# EAGLE design Example (EAGLE 9.6.2)
REVISION: 1.0; SCH_DESC: An Example Schematic; TEAM: Example_Team_Number
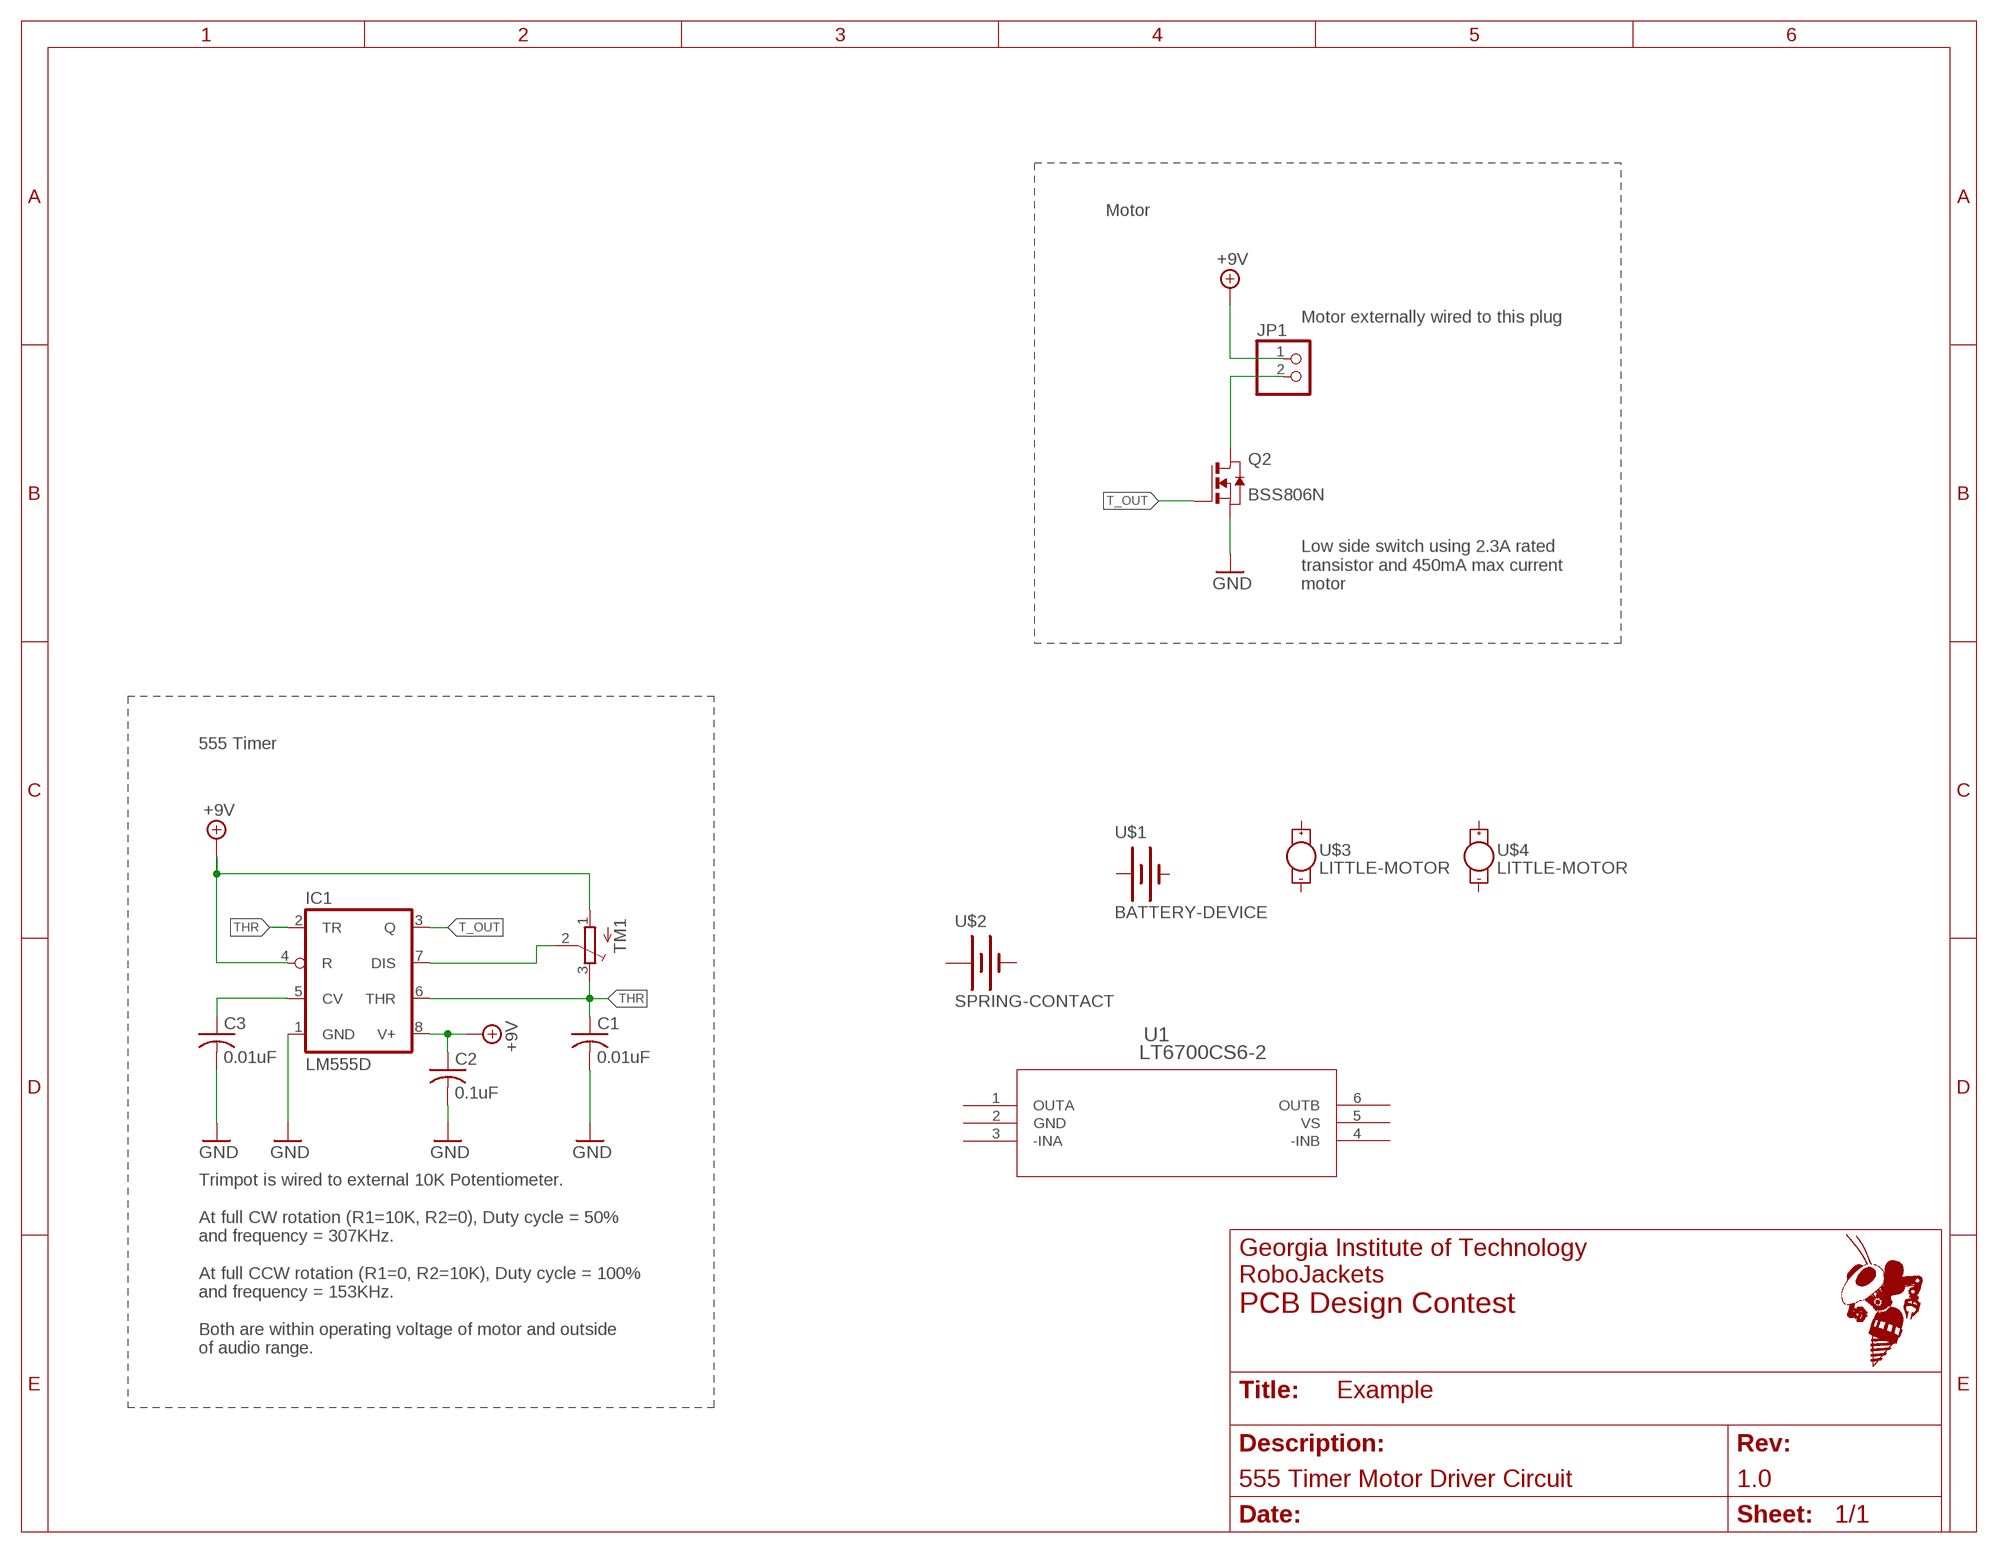
[diagram p0: schematic, sheet 1]
FRAME2 (FRAME_A_L): REVISION: 1.0; SCH_DESC: 555 Timer Motor Driver Circuit; TEAM: PCB Design Contest

## Parts
C1  0.01uF  C-USC0603  [C0603]
C2  0.1uF  C-USC0603  [C0603]
C3  0.01uF  C-USC0603  [C0603]
IC1  LM555D  [SO08]
JP1  PINHD-1X2  [1X02]
Q2  BSS806N  [SOT-23-3]
TM1  TRIMPOT3386  [TRIM-3386]
U1  LT6700CS6-2  [TSOT-23_S6]
U$1  BATTERY-DEVICE  [BATTERY-CASE]
U$2  SPRING-CONTACT  [SPRING-CONTACT]
U$3  LITTLE-MOTOR  [DC_MOTOR]
U$4  LITTLE-MOTOR  [DC_MOTOR]

## Nets
+9V: C2.1 IC1.4(R) IC1.8(V+) JP1.1 TM1.1(A)
GND: C1.2 C2.2 C3.2 IC1.1(GND) Q2.2(S)
N$1: IC1.7(DIS) TM1.2(S)
N$2: JP1.2 Q2.3(D)
N$3: C3.1 IC1.5(CV)
T_OUT: IC1.3(Q) Q2.1(G)
THR: C1.1 IC1.2(TR) IC1.6(THR) TM1.3(E)
Unconnected: U1.1(OUTA) U1.3(-INA) U1.4(-INB) U1.6(OUTB)

## Notes on the sheet
- Motor
- Motor externally wired to this plug
- Low side switch using 2.3A rated
  transistor and 450mA max current
  motor
- 555 Timer
- Trimpot is wired to external 10K Potentiometer.
  
  At full CW rotation (R1=10K, R2=0), Duty cycle = 50%
  and frequency = 307KHz.
  
  At full CCW rotation (R1=0, R2=10K), Duty cycle = 100%
  and frequency = 153KHz.
  
  Both are within operating voltage of motor and outside
  of audio range.

## Power pins joined to a net without a drawn wire
GND: U1.2(GND)
VS: U1.5(VS)

## Library data of the parts
C1-C3 = rcl:C-US: CAPACITOR, American symbol; SPICEPREFIX: C
IC1 = adafruit:*555: TIMER Changed DIP package to have round (not oval) pin pads http://www.ladyada.net/library/pcb/eaglelibrary.html
JP1 = RoboJackets-Connectors:PINHD-1X2: PIN HEADER
Q2 = RoboJackets-Discrete:BSS806N; DKPN: BSS806NH6327XTSA1CT-ND
TM1 = adafruit:TRIMPOT: SMT trimmer potentiometer part number TC33X http://www.ladyada.net/library/eagle
U1 = LT6700CS6-2:LT6700CS6-2; DESCRIPTION: Analog Comparators LT6700 - Micropower, Low Voltage, Dual Comparator with 400mV Reference; DIGI-KEY_PART_NUMBER: LT6700CS6-2#TRMPBFCT-ND; MF: Analog Devices / Linear Technology; MP: LT6700CS6-2; PACKAGE: None
U$1 = battery-stringshooter-holder-18650:BATTERY-DEVICE
U$2 = battery-contact-AA:SPRING-CONTACT
U$3 U$4 = motor-stringshooter:LITTLE-MOTOR

## Board
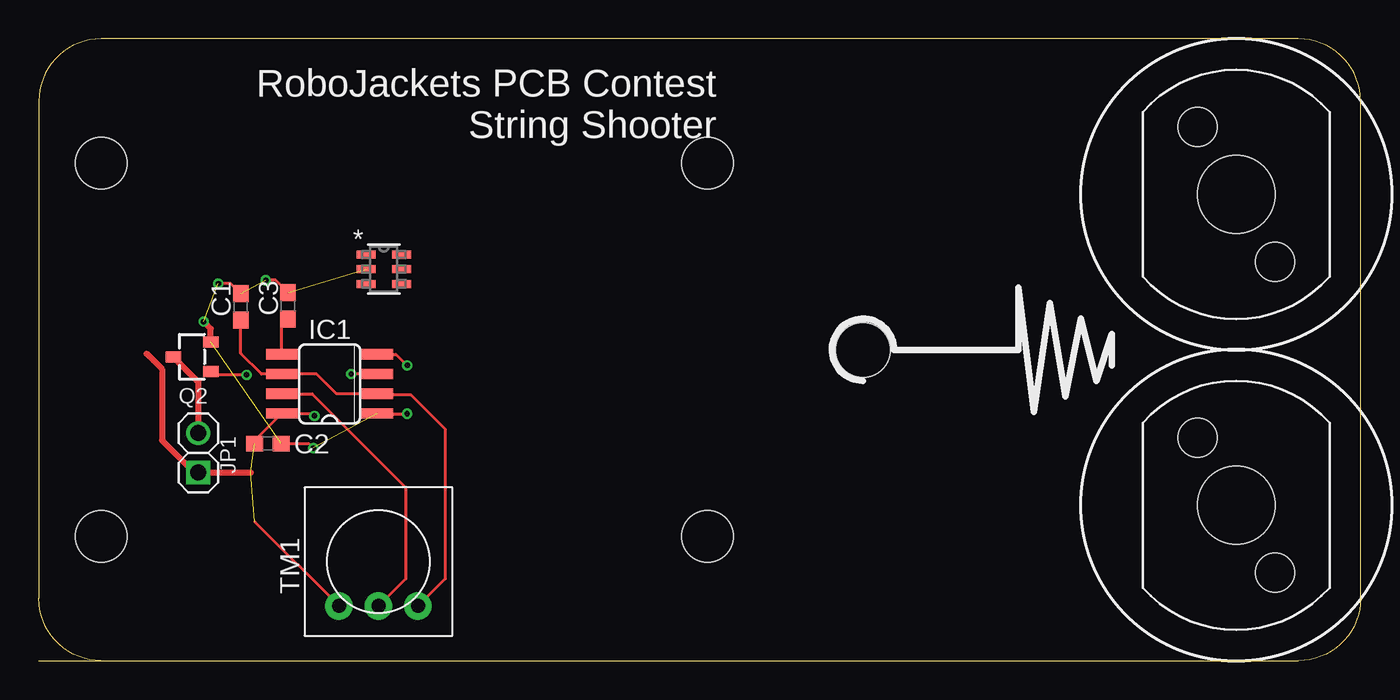
[diagram p1: board, top side]
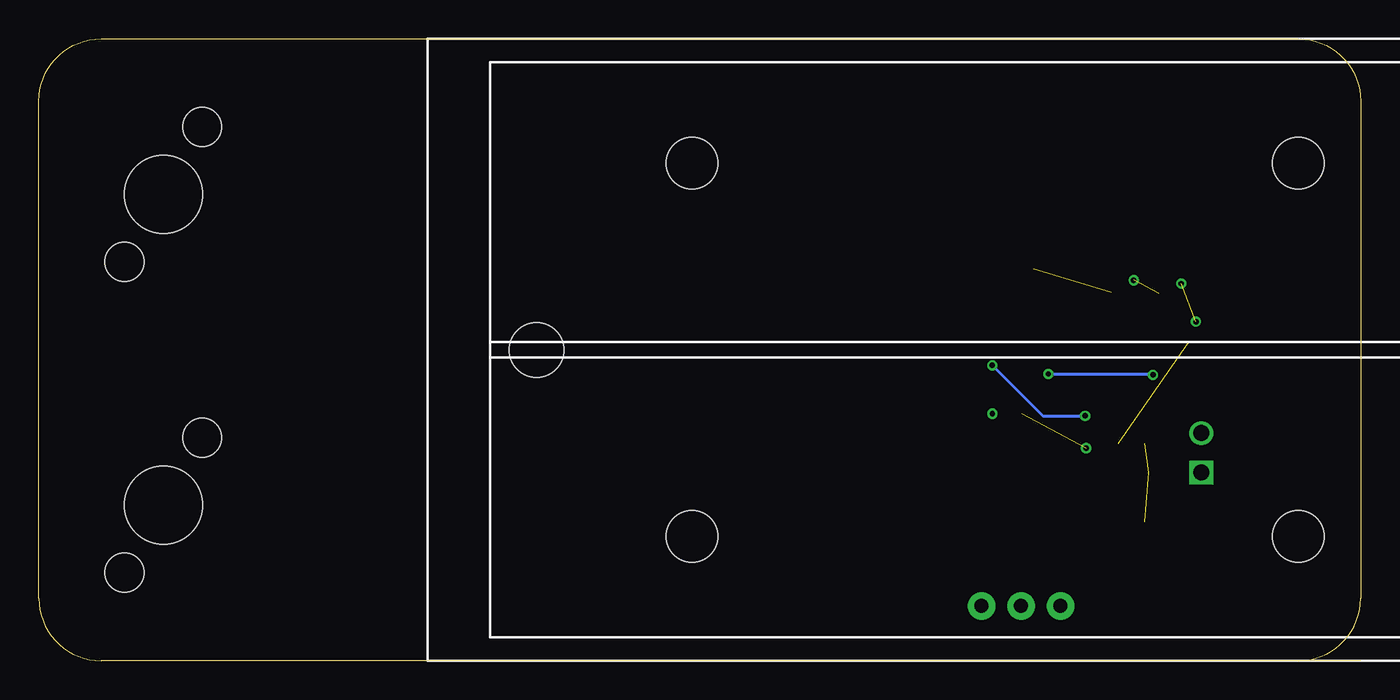
[diagram p2: board, bottom side, seen from below]

Size 85 x 40 mm. Coordinates in mm from the lower left corner, seen from the top.
Outline: 0,0 4,0
Outline: 4,0 81,0 arc90 85,4 85,36 arc90 81,40 4,40 arc90 0,36 0,4 arc90 4,0
Copper layers (1*16): Top 0.035mm / dielectric 1.53mm / Bottom 0.035mm
Design rules "JLCPCB (2 Layer)": minimum track width 5mil, minimum drill 0.3mm, track to track 5mil, track to pad 5mil, pad to pad 5mil, via to via 20mil, smd to smd 5mil, copper to edge 0.2mm, drill to drill 21mil, minimum pad ring 6mil, minimum via ring 6mil, stop-mask expansion 0.05mm, vias tented up to drill 30mil, thermal gap 10mil

### Footprints (pad centres in the part's own frame; a part is rotated, then mirrored left to right if it is on the bottom)
C0603 = smd 1.1 x 1: 1 -0.85,0; 2 0.85,0
SO08 = smd 0.66 x 2.032: 1 -1.905,-3.073; 2 -0.635,-3.073; 3 0.635,-3.073; 4 1.905,-3.073; 5 1.905,3.073; 6 0.635,3.073; 7 -0.635,3.073; 8 -1.905,3.073
1X02 = drill 1.016 square: 1 -1.27,0 | drill 1.016: 2 1.27,0
SOT-23-3 = smd 0.7 x 1: 1 -0.95,-1.2; 2 0.95,-1.2; 3 0,1.2
TRIM-3386 = drill 0.9 pad 1.778: 1 -2.54,-2.857; 2 0,-2.857; 3 2.54,-2.857
TSOT-23_S6 = smd 1.219 x 0.508: 1 -1.143,0.95; 2 -1.143,0; 3 -1.143,-0.95; 4 1.143,-0.95; 5 1.143,0; 6 1.143,0.95
BATTERY-CASE = hole 3.3: 17,32; 56,32; 17,8; 56,8
SPRING-CONTACT = hole 3.5: 4,5
DC_MOTOR = hole 2.5: 3.5,12.33; 8.5,3.66 | hole 5: 6,8

### Placement (x,y rotation side)
C1  12.98,22.76 90 top
C2  14.73,13.96 0 top
C3  16.03,22.82 90 top
IC1  18.7,17.8 90 top
JP1  10.25,13.37 90 top
Q2  9.85,19.54 90 top
TM1  21.84,6.37 0 top
U1  22.18,25.18 0 top
U$1  60,0 0 bottom
U$2  49,15 0 top
U$3  71,22 0 top
U$4  71,2 0 top

### Tracks (layer width: path | path; a pad name or v marks a point on that pad's centre or on a via)
+9V  (via drill 0.35)  (2 unrouted)
  Top 0.2: IC1.4 22.97,19.71 v23.69,18.99 | v17.72,15.75 17.59,15.88 15.65,15.88 IC1.8 13.88,14.16 | TM1.1 13.88,8.93
  Top 0.4: 6.93,19.75 7.92,18.76 7.92,14.17 9.99,12.1 JP1.1 13.62,12.1 | 13.88,14.16 C2.1
  Bottom 0.2: v23.69,18.99 20.45,15.75 v17.72,15.75
GND  (via drill 0.35)  (5 unrouted)
  Top 0.2: C1.2 12.33,24.26 v11.54,24.26 | C3.2 15.23,24.47 v14.59,24.47 | IC1.1 21.79,15.88 v23.68,15.88 | C2.2 17.36,13.96 v17.65,13.67
  Top 0.4: Q2.2 11.05,21.35 v10.59,21.81
N$1
  Top 0.2: TM1.2 23.59,5.26 23.59,11.16 17.58,17.17 IC1.7
N$2
  Top 0.4: Q2.3 10.25,17.94 JP1.2
N$3
  Top 0.2: IC1.5 15.63,21.58 C3.1
T_OUT  (via drill 0.35)
  Top 0.2: IC1.3 v20.08,18.44 | v13.36,18.38 11.26,18.38 Q2.1
  Bottom 0.2: v20.08,18.44 13.42,18.44 v13.36,18.38
THR
  Top 0.2: C1.1 12.98,19.77 14.31,18.44 IC1.6 17.87,18.44 19.14,17.17 IC1.2 21.83,17.11 23.92,17.11 26.13,14.9 26.13,5.26 TM1.3

### Text on the board
tPlace: RoboJackets PCB Contest / String Shooter